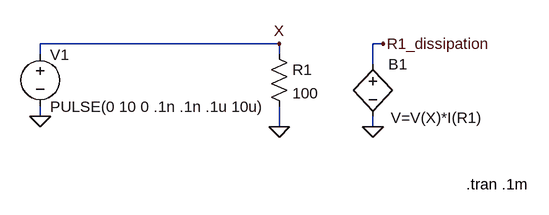
[diagram p0: schematic RMSvsAVE.asc]
RMSvsAVE.asc, the LTspice schematic file:
Version 4
SHEET 1 1516 996
WIRE -288 -112 -288 -128
WIRE -288 -16 -288 -32
WIRE 80 -128 -288 -128
WIRE 80 -112 80 -128
WIRE 80 0 80 -32
WIRE 224 -96 224 -128
WIRE 224 0 224 -16
WIRE 240 -128 224 -128
FLAG -288 -16 0
FLAG 240 -128 R1_dissipation
FLAG 80 0 0
FLAG 224 0 0
FLAG 80 -128 X
SYMBOL voltage -288 -128 R0
WINDOW 123 0 0 Left 0
WINDOW 39 0 0 Left 0
WINDOW 0 15 17 Left 0
WINDOW 3 15 97 Left 0
SYMATTR InstName V1
SYMATTR Value PULSE(0 10 0 .1n .1n .1u 10u)
SYMBOL res 64 -128 R0
SYMATTR InstName R1
SYMATTR Value 100
SYMBOL bv 224 -112 R0
WINDOW 3 28 98 Left 0
SYMATTR Value V=V(X)*I(R1)
SYMATTR InstName B1
SYMATTR Value2 tripdv=1e308
SYMATTR SpiceLine NoJacob
TEXT 368 88 Left 0 !.tran .1m

The netlist it stands for:
* RMSvsAVE.asc
V1 X 0 PULSE(0 10 0 .1n .1n .1u 10u)
R1 X 0 100
B1 R1_dissipation 0 V=V(X)*I(R1) tripdv=1e308 NoJacob
.tran .1m
.backanno
.end